# Altium schematic sheet Sheet1.SchDoc
size 594 x 420 mm; SheetNumber: ?; SheetTotal: ?; Scale: -; DocumentType: Схема электрическая принципиальная; DocumentGOSTLIt1: ㅤ; DocumentGOSTLIt2: ㅤ; DocumentGOSTLIt3: ㅤ; DocumentGOSTNote: Элементы, отмеченные *, используются при трассировке печатной платы, в состав модуля не включаются.; DocumentTypeShort: Э3; DocumentInvertoryNumber: ㅤ
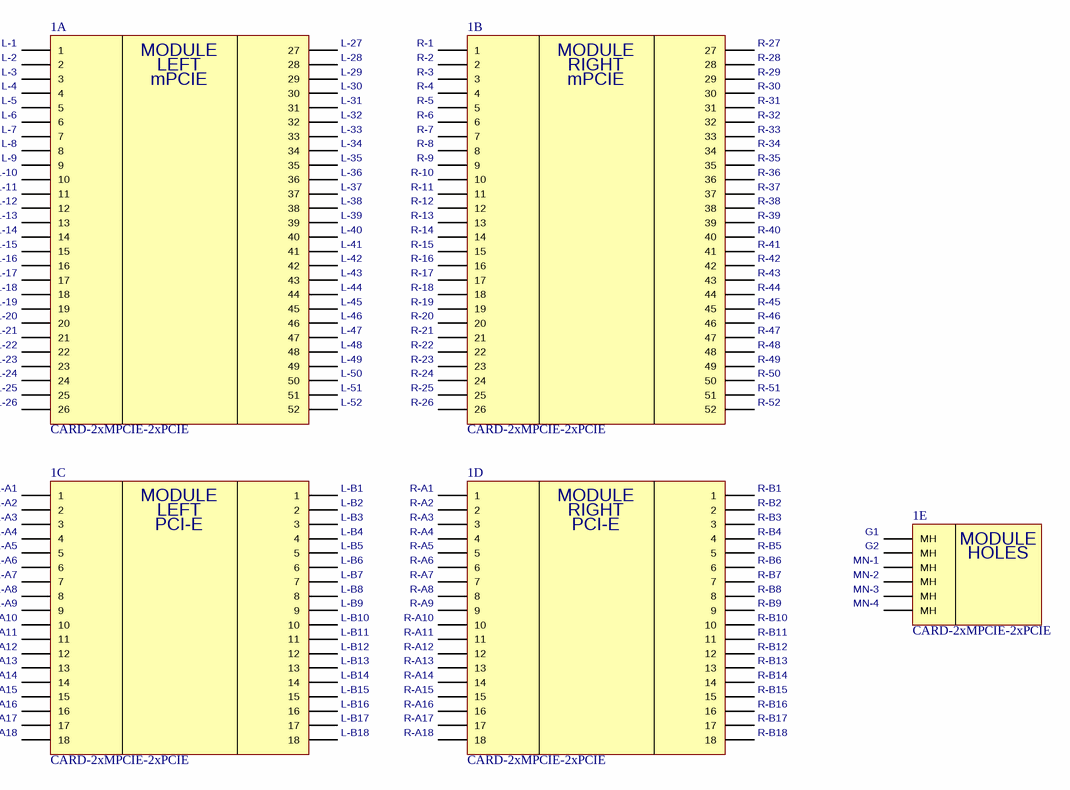
[diagram p0: Sheet1.SchDoc]

## Parts
1  CARD-2xMPCIE-2xPCIE  [CARD-2xMPCIE-2xPCIE]  (parts A,B,C,D,E of 5)  (no BOM)

## Nets

Not connected (* = marked no-connect by the designer): 1 G1(MH) G2(MH) L-1(1) L-2(2) L-3(3) L-4(4) L-5(5) L-6(6) L-7(7) L-8(8) L-9(9) L-10(10) L-11(11) L-12(12) L-13(13) L-14(14) L-15(15) L-16(16) L-17(17) L-18(18) L-19(19) L-20(20) L-21(21) L-22(22) L-23(23) L-24(24) L-25(25) L-26(26) L-27(27) L-28(28) L-29(29) L-30(30) L-31(31) L-32(32) L-33(33) L-34(34) L-35(35) L-36(36) L-37(37) L-38(38) L-39(39) L-40(40) L-41(41) L-42(42) L-43(43) L-44(44) L-45(45) L-46(46) L-47(47) L-48(48) L-49(49) L-50(50) L-51(51) L-52(52) L-A1(1) L-A2(2) L-A3(3) L-A4(4) L-A5(5) L-A6(6) L-A7(7) L-A8(8) L-A9(9) L-A10(10) L-A11(11) L-A12(12) L-A13(13) L-A14(14) L-A15(15) L-A16(16) L-A17(17) L-A18(18) L-B1(1) L-B2(2) L-B3(3) L-B4(4) L-B5(5) L-B6(6) L-B7(7) L-B8(8) L-B9(9) L-B10(10) L-B11(11) L-B12(12) L-B13(13) L-B14(14) L-B15(15) L-B16(16) L-B17(17) L-B18(18) MN-1(MH) MN-2(MH) MN-3(MH) MN-4(MH) R-1(1) R-2(2) R-3(3) R-4(4) R-5(5) R-6(6) R-7(7) R-8(8) R-9(9) R-10(10) R-11(11) R-12(12) R-13(13) R-14(14) R-15(15) R-16(16) R-17(17) R-18(18) R-19(19) R-20(20) R-21(21) R-22(22) R-23(23) R-24(24) R-25(25) R-26(26) R-27(27) R-28(28) R-29(29) R-30(30) R-31(31) R-32(32) R-33(33) R-34(34) R-35(35) R-36(36) R-37(37) R-38(38) R-39(39) R-40(40) R-41(41) R-42(42) R-43(43) R-44(44) R-45(45) R-46(46) R-47(47) R-48(48) R-49(49) R-50(50) R-51(51) R-52(52) R-A1(1) R-A2(2) R-A3(3) R-A4(4) R-A5(5) R-A6(6) R-A7(7) R-A8(8) R-A9(9) R-A10(10) R-A11(11) R-A12(12) R-A13(13) R-A14(14) R-A15(15) R-A16(16) R-A17(17) R-A18(18) R-B1(1) R-B2(2) R-B3(3) R-B4(4) R-B5(5) R-B6(6) R-B7(7) R-B8(8) R-B9(9) R-B10(10) R-B11(11) R-B12(12) R-B13(13) R-B14(14) R-B15(15) R-B16(16) R-B17(17) R-B18(18)

## Notes on the sheet
- Перв. примен.
- Справ. №
- Подп. и дата
- Инв. № дубл.
- Взам. инв. №
- Разраб.
- Изм.
- Лист
- № докум.
- Подп.
- Дата
- Лит.
- Масса
- Масштаб
- Пров.
- Т. контр.
- -
- Листов
- Инв. № подл.
- Утв.
- Н. контр.
- Копировал
- Формат А2
- (in symbol PCB-CARD-MODULE, part A) MODULE; LEFT; mPCIE
- (in symbol PCB-CARD-MODULE, part B) MODULE; RIGHT; mPCIE
- (in symbol PCB-CARD-MODULE, part C) MODULE; LEFT; PCI-E
- (in symbol PCB-CARD-MODULE, part D) MODULE; RIGHT; PCI-E
- (in symbol PCB-CARD-MODULE, part E) MODULE; HOLES

## Library data of the parts
1 = PCB-CARD-MODULE